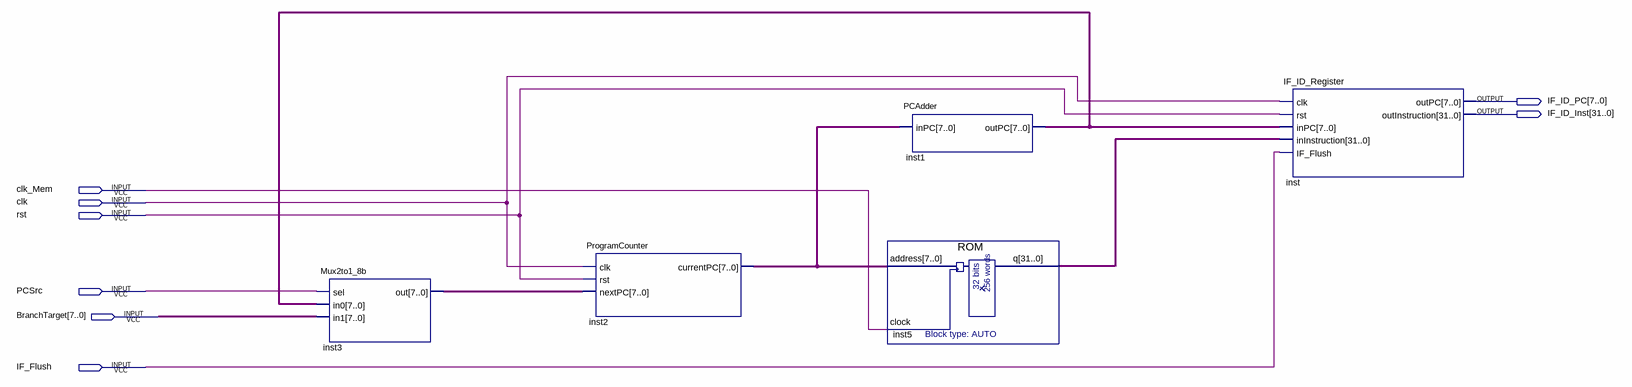
[diagram p0: schematic sheet]
// Quartus schematic IF_STAGE.bdf as structural Verilog: 5 symbols, 8 pins
module IF_STAGE (
  input  clk_Mem,
  input  clk,
  input  rst,
  input  PCSrc,
  input  [7:0] BranchTarget,
  input  IF_Flush,
  output [7:0] IF_ID_PC,
  output [31:0] IF_ID_Inst
);

  wire [7:0] inst1_outpc, inst2_currentpc, inst3_out;
  wire [31:0] inst5_q;

  Mux2to1_8b inst3 (.sel(PCSrc), .in0(inst1_outpc), .in1(BranchTarget), .out(inst3_out));
  ProgramCounter inst2 (.clk(clk), .rst(rst), .nextPC(inst3_out), .currentPC(inst2_currentpc));
  PCAdder inst1 (.inPC(inst2_currentpc), .outPC(inst1_outpc));
  ROM inst5 (.address(inst2_currentpc), .clock(clk_Mem), .q(inst5_q));
  IF_ID_Register inst (
    .clk(clk), .rst(rst), .inPC(inst1_outpc), .inInstruction(inst5_q), .IF_Flush(IF_Flush), .outPC(IF_ID_PC),
    .outInstruction(IF_ID_Inst));
endmodule
